# Altium schematic sheet SC945D_Audio.SchDoc: Audio
size 393 x 270 mm; CompanyName: Seccom; Address1: 521, rue du capt. François Garbit; Address2: 69440 Mornant; Address3: seccom@seccom.fr; Address4: www.seccom.fr; DocumentNumber: 6; SheetNumber: 6; SheetTotal: 9; PageSetup: Record=PageOptions|CenterHorizontal=True|CenterVertical=True|PrintScale=0.74|XCorrection=1.00|YCorrection=1.00|PrintKind=0|BorderSize=5000000|LeftOffset=0|BottomOffset=0|Orientation=2|PaperLength=1000|PaperWidth=1000|Scale=100|PaperSource=7|PrintQuality=-4|MediaType=1|DitherType=10|PaperKind=A4|PrintScaleMode=1
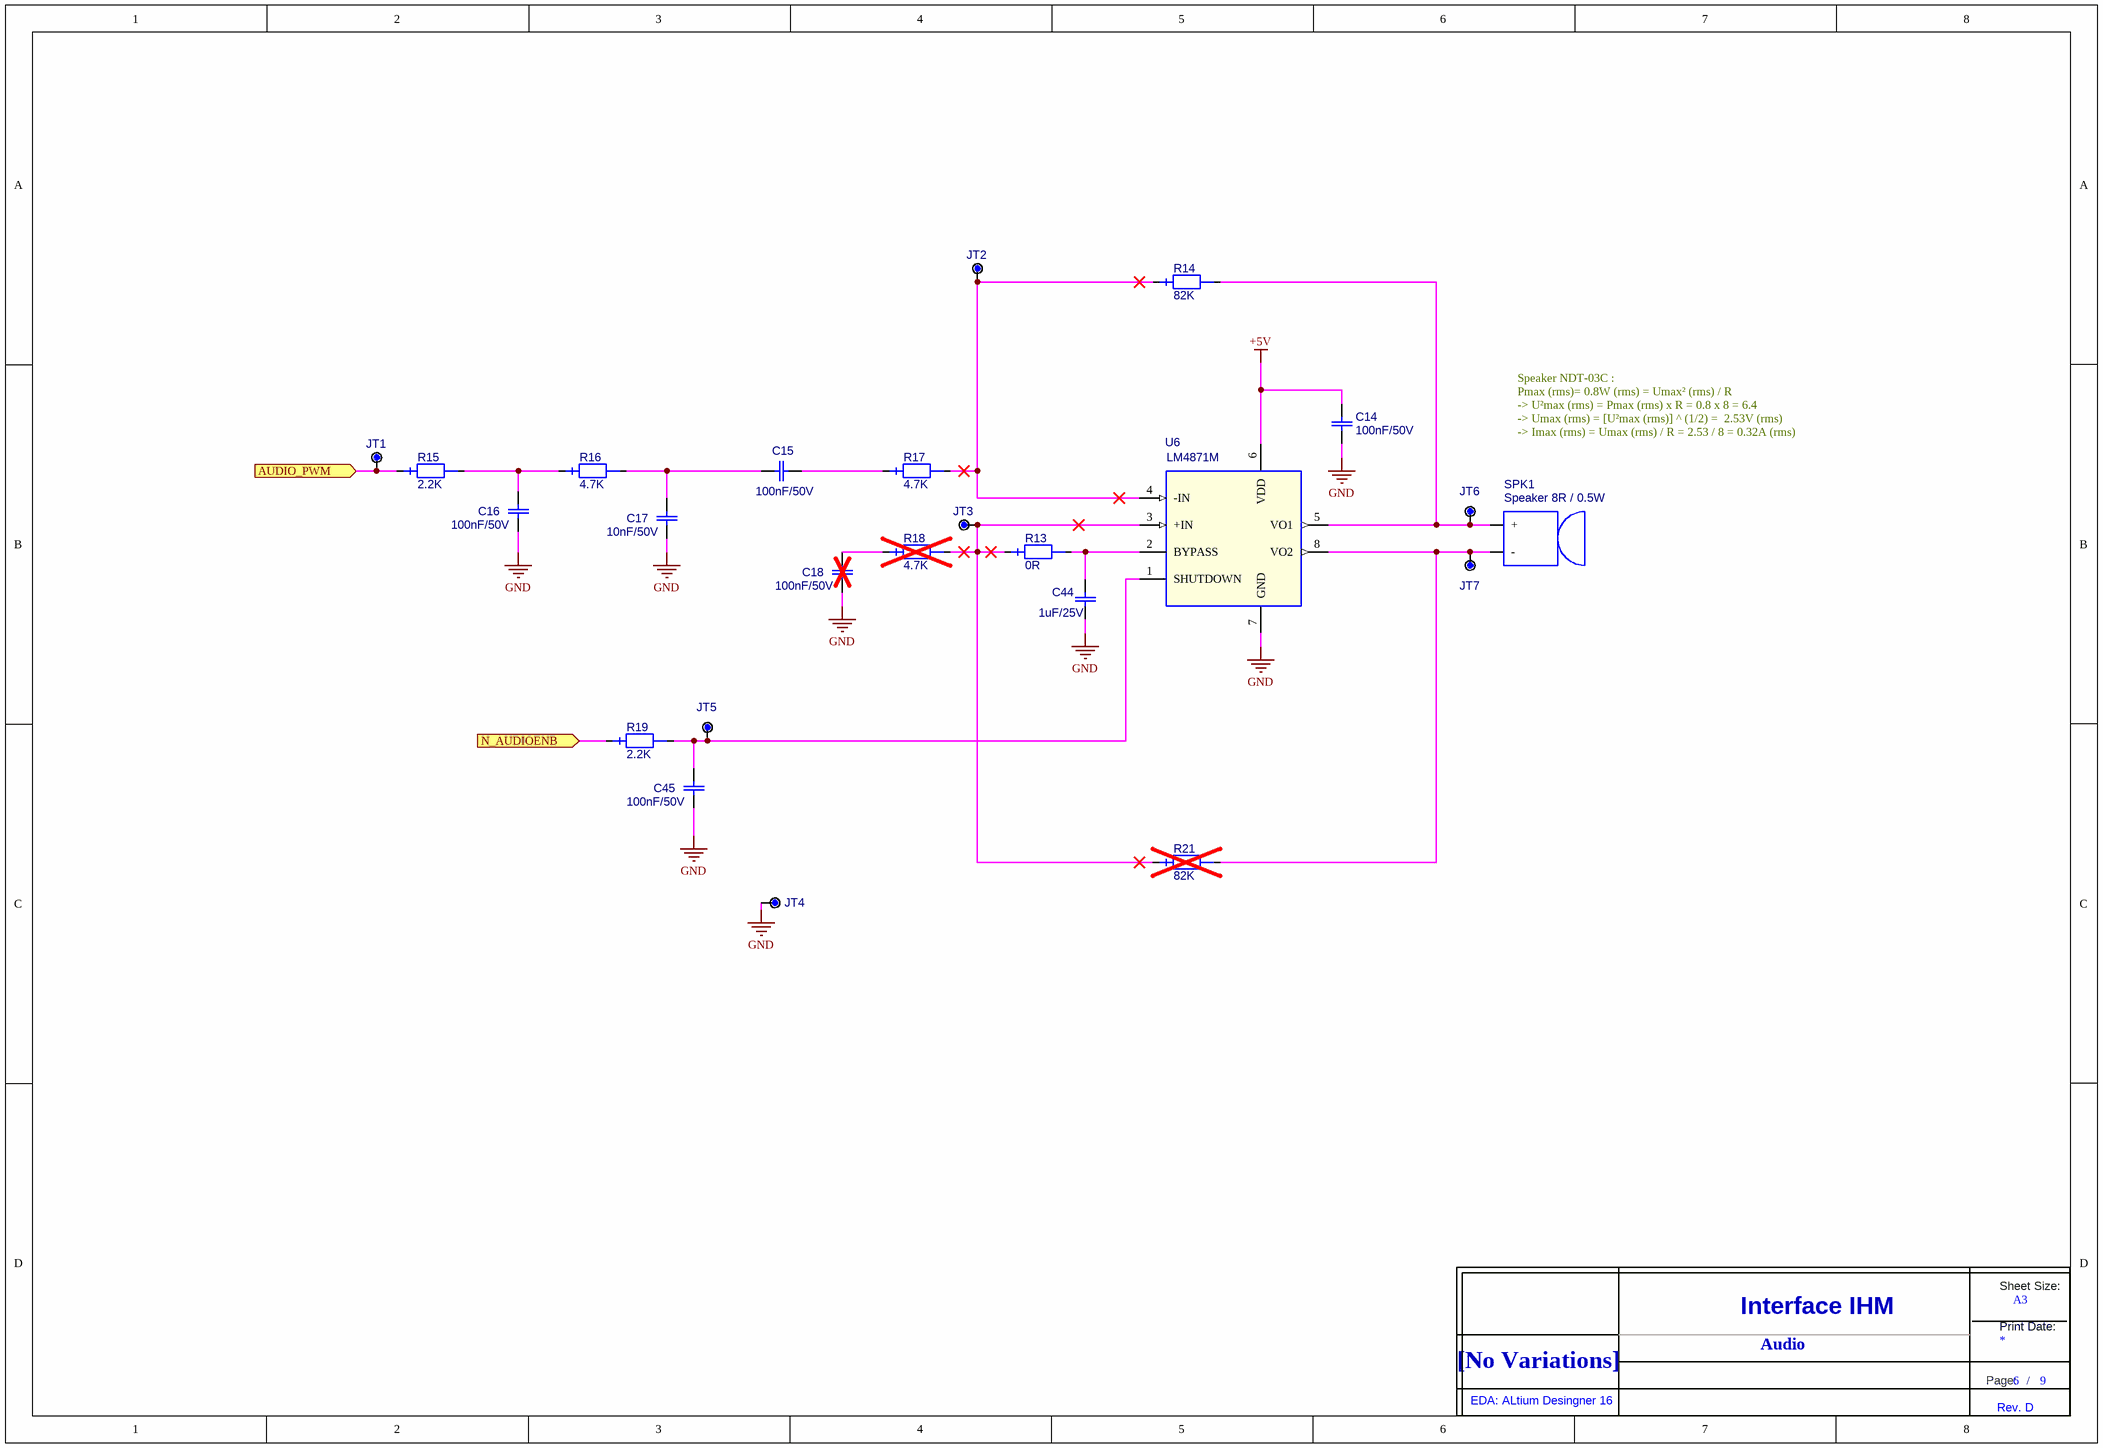
[diagram p0: SC945D_Audio.SchDoc]

## Parts
C14  value 100nF/50V  [0603_ReflowSoldering_CAP]  (hidden comment: C_0603_X7R_10%_100N-50V)
C15  value 100nF/50V  [0603_ReflowSoldering_CAP]  (hidden comment: C_0603_X7R_10%_100N-50V)
C16  value 100nF/50V  [0603_ReflowSoldering_CAP]  (hidden comment: C_0603_X7R_10%_100N-50V)
C17  value 10nF/50V  [0603_ReflowSoldering_CAP]  (hidden comment: C_0603_X7R_10%_10N-50V)
C18  value 100nF/50V  [0603_ReflowSoldering_CAP]  (hidden comment: C_0603_X7R_10%_100N-50V)  (no BOM)
C44  value 1uF/25V  [0805_ReflowSoldering_CAP]  (hidden comment: C_0805_X5R_10%_1U-25V)
C45  value 100nF/50V  [0603_ReflowSoldering_CAP]  (hidden comment: C_0603_X7R_10%_100N-50V)
JT1  POINT_TEST_PAD_40MIL  [PAD_CMS_40X40_E]  (value not drawn)  (no BOM)
JT2  POINT_TEST_PAD_40MIL  [PAD_CMS_40X40_E]  (value not drawn)  (no BOM)
JT3  POINT_TEST_PAD_40MIL  [PAD_CMS_40X40_E]  (value not drawn)  (no BOM)
JT4  POINT_TEST_PAD_40MIL  [PAD_CMS_40X40_E]  (value not drawn)  (no BOM)
JT5  POINT_TEST_PAD_40MIL  [PAD_CMS_40X40_E]  (value not drawn)  (no BOM)
JT6  POINT_TEST_PAD_40MIL  [PAD_CMS_40X40_E]  (value not drawn)  (no BOM)
JT7  POINT_TEST_PAD_40MIL  [PAD_CMS_40X40_E]  (value not drawn)  (no BOM)
R13  value 0R  [0603_ReflowSoldering_RES]  (hidden comment: RES_0603_1%_100PPM_0R)
R14  value 82K  [0603_ReflowSoldering_RES]  (hidden comment: RES_0603_1%_100PPM_82K)
R15  value 2.2K  [0603_ReflowSoldering_RES]  (hidden comment: RES_0603_1%_100PPM_2.2K)
R16  value 4.7K  [0603_ReflowSoldering_RES]  (hidden comment: RES_0603_1%_100PPM_4.7K)
R17  value 4.7K  [0603_ReflowSoldering_RES]  (hidden comment: RES_0603_1%_100PPM_4.7K)
R18  value 4.7K  [0603_ReflowSoldering_RES]  (hidden comment: RES_0603_1%_100PPM_4.7K)  (no BOM)
R19  value 2.2K  [0603_ReflowSoldering_RES]  (hidden comment: RES_0603_1%_100PPM_2.2K)
R21  value 82K  [0603_ReflowSoldering_RES]  (hidden comment: RES_0603_1%_100PPM_82K)  (no BOM)
SPK1  value Speaker 8R / 0.5W  [SPEAKER_15x15MM_NDT-03C_SMS1313-08H04LF]  (hidden comment: SPEAKER_8R_0.5W_NDT-03C)
Title_new?  DNI  (value not drawn)  (graphical)
U6  LM4871M  [SOIC_08_E1,27_L150_ReflowSoldering]

## Ports
AUDIO_PWM (in), N_AUDIOENB (in)

## Nets
+5V: C14.2 U6.6(VDD)
GND: C14.1 C16.1 C17.1 C18.1 C44.1 C45.1 JT4.1 U6.7(GND)
AUDIO_PWM: JT1.1 R15.1 ; port AUDIO_PWM
N_AUDIOENB: R19.1 ; port N_AUDIOENB
NetC15_1: C15.1 R17.1
NetC15_2: C15.2 C17.2 R16.2
NetC16_2: C16.2 R15.2 R16.1
NetC18_2: C18.2 R18.1
NetC44_2: C44.2 R13.2 U6.2(BYPASS)
NetC45_2: C45.2 JT5.1 R19.2 U6.1(SHUTDOWN)
NetJT2_1: JT2.1 R14.1 R17.2 U6.4(-IN)
NetJT3_1: JT3.1 R13.1 R18.2 R21.1 U6.3(+IN)
NetJT6_1: JT6.1 R14.2 SPK1.1(+) U6.5(VO1)
NetJT7_1: JT7.1 R21.2 SPK1.2(-) U6.8(VO2)

Not connected (* = marked no-connect by the designer): SPK1 FIX1 FIX2

## Notes on the sheet
- Speaker NDT-03C :
  Pmax (rms)= 0.8W (rms) = Umax² (rms) / R
  -> U²max (rms) = Pmax (rms) x R = 0.8 x 8 = 6.4
  -> Umax (rms) = [U²max (rms)] ^ (1/2) =  2.53V (rms)
  -> Imax (rms) = Umax (rms) / R = 2.53 / 8 = 0.32A (rms)
- Audio
- (in symbol Title_new) Sheet Size:; A3; Interface IHM; Print Date:; [No Variations]; Page:; /; EDA: ALtium Desingner 16; Rev. D

## Library data of the parts
C14-C16 C18 C45 = C_0603_X7R_10%_100N-50V: Condensateur céramique, X7R, 10%, CMS 0603, 100nF/50V; Creation: FB (29/02/12); Boitier: 0603; Remarque: {Remarque}; Fabricant: Kemet; Ref Fab: C0603C104K5RAC; Coeff: 1; ComponentLink1URL: O:\_Documentation\Datasheets\Kemet\Condos_Ceramic_CMS.pdf; ComponentLink2URL: o:\_Documentation\Datasheets\_BOITIERS\PASSIF_CMS\; Config: *; ComponentLink1Description: Datasheet; ComponentLink2Description: Datasheet Boitier; Supplier 1: Farnell; Supplier Part Number 1: 1288255
C17 = C_0603_X7R_10%_10N-50V: Condensateur céramique, X7R, 10%, CMS 0603, 10nF/50V; Creation: FB (01/03/12); Boitier: 0603; Remarque: {Remarque}; Fabricant: Kemet; Ref Fab: C0603C103K5RAC; Coeff: 1; ComponentLink1URL: O:\_Documentation\Datasheets\Kemet\Condos_Ceramic_CMS.pdf; ComponentLink2URL: o:\_Documentation\Datasheets\_BOITIERS\PASSIF_CMS\; Config: *; ComponentLink1Description: Datasheet; ComponentLink2Description: Datasheet Boitier; Supplier 1: Farnell; Supplier 2: RadioSpares; Supplier Part Number 1: 1414609; Supplier Part Number 2: 2644595
C44 = C_0805_X5R_10%_1U-25V: Condensateur céramique, X5R, 10%, CMS 0805; Creation: FB (07/03/12); Reference: 001834/00; Boitier: 0805; Remarque: {Remarque}; Coeff: 1; Fabricant: AVX; Ref Fab: 08053D105KAT2A; Verification: *; ComponentLink1URL: O:\_Documentation\Datasheets\AVX\Condensateurs_CMS_Ceramic_X5R.pdf; ComponentLink2URL: o:\_Documentation\Datasheets\_Boitiers\PASSIF_CMS\RC_0805_(2x1,25)_(Schneider).pdf; Config: *; ComponentLink1Description: Datasheet; ComponentLink2Description: Datasheet Boitier; Supplier Part Number 1: 1327695; Supplier Part Number 2: 6983409; Supplier 1: Farnell; Supplier 2: Radiospares
JT1-JT7 = POINT_TEST_PAD_40MIL: Point de test sur CI, pad de diamètre 1.016mm (40mils); Creation: FB (04/10/12); Remarque: {Remarque}; Coeff: 1; Value: POINT_TEST; Config: *; ComponentLink1Description: Datasheet; ComponentLink2Description: Datasheet Boitier
R13 = RES_0603_1%_100PPM_0R: Résistance, 0.100W, 1%, 100ppm, 75V, 0R; Creation: FB (04/07/12); Boitier: 0603; Remarque: {Remarque}; Fabricant: Vishay; Ref Fab: CRCW06030000Z0EA; Coeff: 1; Verification: *; ComponentLink1URL: O:\_Documentation\Datasheets\Vishay\Resistances_D-CRCWe3.pdf; ComponentLink2URL: o:\_Documentation\Datasheets\_BOITIERS\PASSIF_CMS\; Config: *; ComponentLink1Description: Datasheet; ComponentLink2Description: Datasheet Boitier; Supplier 1: Farnell; Supplier Part Number 1: 1469739
R14 R21 = RES_0603_1%_100PPM_82K: Résistance, 0.100W, 1%, 100ppm, 75V, 82K; Creation: FB (01/03/12); Boitier: 0603; Remarque: {Remarque}; Fabricant: Vishay; Ref Fab: CRCW060382K0FKEA; Coeff: 1; Verification: *; ComponentLink1URL: O:\_Documentation\Datasheets\Vishay\Resistances_D-CRCWe3.pdf; ComponentLink2URL: o:\_Documentation\Datasheets\_BOITIERS\PASSIF_CMS\; Config: *; ComponentLink1Description: Datasheet; ComponentLink2Description: Datasheet Boitier; Supplier 1: Farnell; Supplier 2: RadioSpares; Supplier Part Number 1: 1152140; Supplier Part Number 2: 6790737
R15 R19 = RES_0603_1%_100PPM_2.2K: Résistance, 0.100W, 1%, 100ppm, 75V, 2.2K; Creation: JPL (05/07/12); Boitier: 0603; Remarque: {Remarque}; Fabricant: Vishay; Ref Fab: CRCW06032K20FKEA; Coeff: 1; Verification: *; ComponentLink1URL: O:\_Documentation\Datasheets\Vishay\Resistances_D-CRCWe3.pdf; ComponentLink2URL: o:\_Documentation\Datasheets\_BOITIERS\PASSIF_CMS\; Config: *; ComponentLink1Description: Datasheet; ComponentLink2Description: Datasheet Boitier; Supplier 1: Farnell; Supplier 2: RadioSpares; Supplier Part Number 1: 1469765; Supplier Part Number 2: 6790112
R16-R18 = RES_0603_1%_100PPM_4.7K: Résistance, 0.100W, 1%, 100ppm, 75V, 4.7K; Creation: JPL (05/07/12); Boitier: 0603; Remarque: {Remarque}; Fabricant: Vishay; Ref Fab: CRCW06034K70FKEA; Coeff: 1; Verification: *; ComponentLink1URL: O:\_Documentation\Datasheets\Vishay\Resistances_D-CRCWe3.pdf; ComponentLink2URL: o:\_Documentation\Datasheets\_BOITIERS\PASSIF_CMS\; Config: *; ComponentLink1Description: Datasheet; ComponentLink2Description: Datasheet Boitier; Supplier 1: Farnell; Supplier 2: RadioSpares; Supplier Part Number 1: 1469807; Supplier Part Number 2: 6790484
SPK1 = SPEAKER_8R_0.5W_NDT-03C: Speaker dynamique, impedance 8R, Pnom=0.5W, Pmax=0.8W, Fres=800Hz, 90dBA, -30/+85°C, CMS; Creation: FB (29/02/12); Boitier: 15x15x4mm; Remarque: {Remarque}; Fabricant: Star-Micronics; Coeff: 1; Ref Fab: NDT-03C; ComponentLink1URL: O:\_Documentation\Datasheets\Star_Micronics\NDT-03C_Datasheet.pdf; ComponentLink2URL: O:\_Documentation\Datasheets\Star_Micronics\NDT-03C_Footprint.pdf; Config: *; ComponentLink1Description: Datasheet; ComponentLink2Description: Datasheet Boitier; Supplier 1: Farnell; Supplier Part Number 1: 1299760
Title_new? = Title_new
U6 = LM4871M: Amplificateur audio avec shutdown, 1.5W/8ohm, Vdd=2~5.5V, -40/+125°C, CMS; Creation: PDP (11/07/12); Verification: FB (11/09/12); Boitier: SOIC 8; Remarque: {Remarque}; Coeff: 1; Fabricant: National Semiconductor; Ref Fab: LM4871M/NOPB; ComponentLink1URL: o:\_Documentation\Datasheets\National_SemiConductors\LM4871.pdf; ComponentLink2URL: o:\_Documentation\Datasheets\_Boitiers\ACTIF_CMS\; ComponentLink1Description: Datasheet; ComponentLink2Description: Datasheet Boitier; Supplier 1: Farnell; Supplier Part Number 1: 1468873; Supplier 2: Mouser; Supplier Part Number 2: 926-LM4871M/NOPB; Value: LM4871M